# Altium schematic sheet Power Management.SchDoc
size A; SheetNumber: 2; SheetTotal: 4
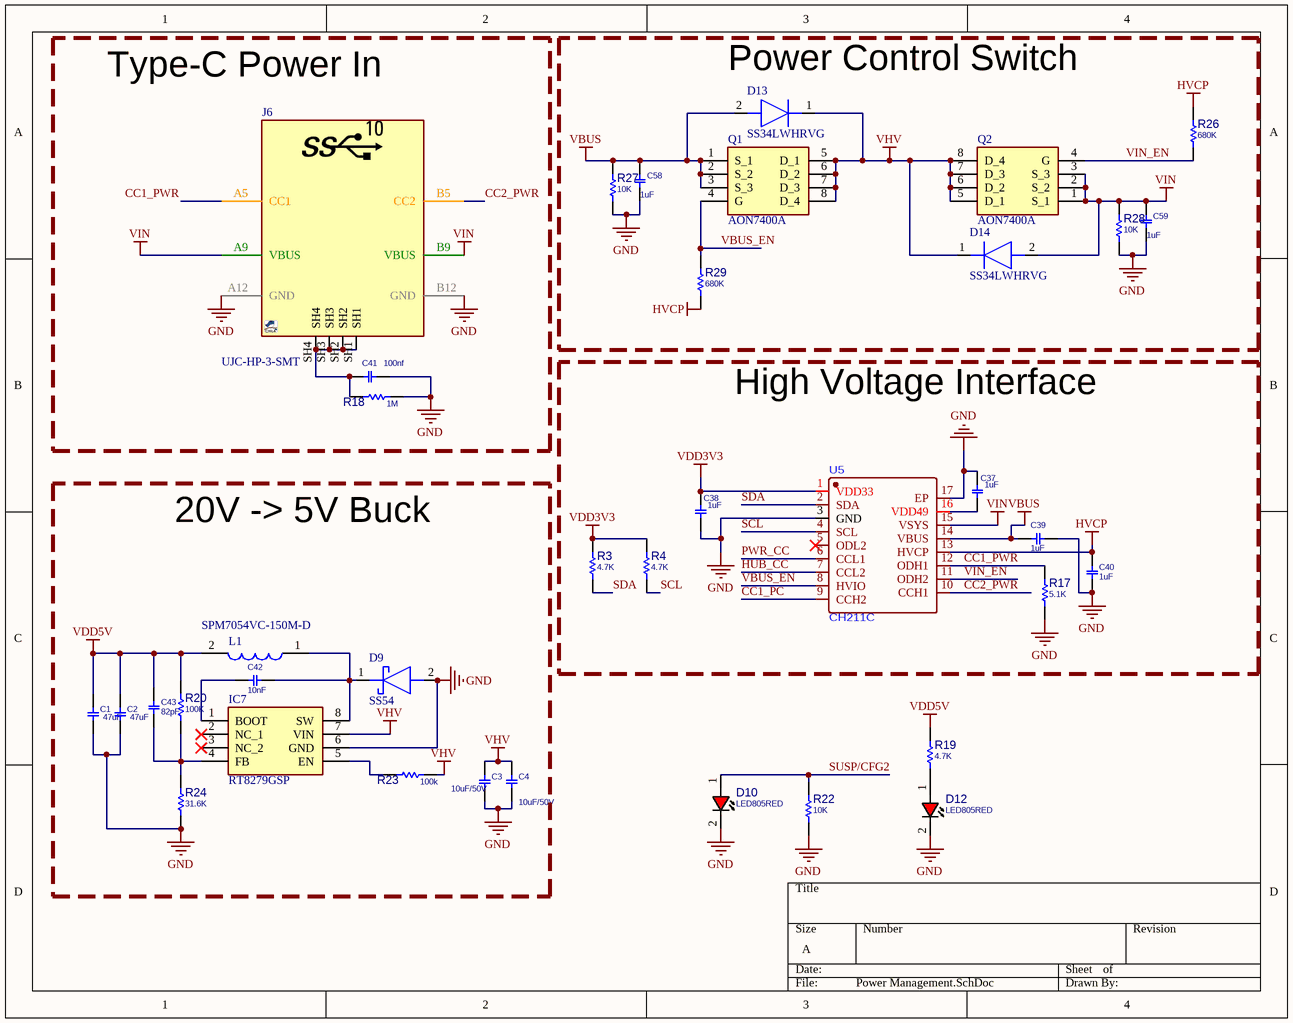
[diagram p0: Power Management.SchDoc]

## Parts
C1  47uF  [C0805]
C2  47uF  [C0805]
C3  10uF/50V  [C0805]
C4  10uF/50V  [C0805]
C37  1uF  [C0805]
C38  1uF  [C0805]
C39  1uF  [C0805]
C40  1uF  [C0805]
C41  100nf  [C1812]
C42  10nF  [C0402]
C43  82pF  [C0402]
C58  1uF  [C0402]
C59  1uF  [C0402]
D9  SS54  [DIOM5026X262N]
D10  LED805RED  [LED0805RED]
D12  LED805RED  [LED0805RED]
D13  SS34LWHRVG  [SODFL3718X102N]
D14  SS34LWHRVG  [SODFL3718X102N]
IC7  RT8279GSP  [SOIC127P600X175-8N]
J6  UJC-HP-3-SMT  [USBC_SMD_6_UJCHP3SMT]
L1  SPM7054VC-150M-D  [SPM7054VC150MD]
Q1  AON7400A  [DFN_3X3_EP]
Q2  AON7400A  [DFN_3X3_EP]
R3  4.7K  [R0402]
R4  4.7K  [R0402]
R17  5.1K  [R0402]
R18  1M  [R0805]
R19  4.7K  [R0402]
R20  100K  [R0402]
R22  10K  [R0402]
R23  100k  [R0402]
R24  31.6K  [R0402]
R26  680K  [R0402]
R27  10K  [R0402]
R28  10K  [R0402]
R29  680K  [R0402]
U5  CH211C  [QFN-16C_L2.0-W2.0-P0.40-BL-EP1.2]

## Blocks framed on the sheet
Type-C Power In: C41 J6 R18
Power Control Switch: C58 C59 D13 D14 Q1 Q2 R26-R29
High Voltage Interface: C37-C40 R3 R4 R17 U5
20V -> 5V Buck: C1-C4 C42 C43 D9 IC7 L1 R20 R23 R24

## Nets
GND: C1.1 C2.1 C3.1 C4.1 C37.2 C38.1 C39.1 C40.2 C41.2 C58.1 C59.1 D9.2(A) D10.2(CATHODE) D12.2(CATHODE) IC7.6(GND) J6.A12(GND) J6.B12(GND) R17.2 R18.1 R22.2 R24.2 R27.2 R28.2 U5.3(GND) U5.17(EP)
HVCP: C40.1 R26.2 R29.2 U5.13(HVCP)
VBUS: C39.2 C58.2 D13.2(A) Q1.1(S_1) Q1.2(S_2) Q1.3(S_3) R27.1 U5.14(VBUS)
VDD3V3: C38.2 R3.1 R4.1 U5.1(VDD33)
VDD5V: C1.2 C2.2 C43.1 L1.2 R19.1 R20.1
VHV: C3.2 C4.2 D13.1(K) D14.1(K) IC7.7(VIN) Q1.5(D_1) Q1.6(D_2) Q1.7(D_3) Q1.8(D_4) Q2.5(D_1) Q2.6(D_2) Q2.7(D_3) Q2.8(D_4) R23.1
VIN: C59.2 D14.2(A) J6.A9(VBUS) J6.B9(VBUS) Q2.1(S_1) Q2.2(S_2) Q2.3(S_3) R28.1 U5.15(VSYS)
CC1_PC: U5.9(CCH2)
CC1_PWR: J6.A5(CC1) R17.1 U5.12(ODH1)
CC2_PWR: J6.B5(CC2) U5.10(CCH1)
HUB_CC: U5.7(CCL2)
PWR_CC: U5.6(CCL1)
SCL: R4.2 U5.4(SCL)
SDA: R3.2 U5.2(SDA)
SUSP/CFG2: D10.1(ANODE) R22.1
VBUS_EN: Q1.4(G) R29.1 U5.8(HVIO)
VIN_EN: Q2.4(G) R26.1 U5.11(ODH2)
NetC37_1: C37.1 U5.16(VDD49)
NetC41_1: C41.1 J6.SH1 J6.SH2 J6.SH3 J6.SH4 R18.2
NetC42_1: C42.1 D9.1(K) IC7.8(SW) L1.1
NetC42_2: C42.2 IC7.1(BOOT)
NetC43_2: C43.2 IC7.4(FB) R20.2 R24.1
NetD12_1: D12.1(ANODE) R19.2
NetIC7_5: IC7.5(EN) R23.2

Not connected (* = marked no-connect by the designer): IC7 2(NC_1)* 3(NC_2)*; U5 5(ODL2)*

## Library data of the parts
C1-C3 C37-C40 = CAP_SMD_MLCC_0805
C4 = CAP_SMD_MLCC_0402: 50V
C41 = CAP_SMD_MLCC_1812: +1kv 100nf
C42 C43 C58 C59 = CAP_SMD_MLCC_0402
D9 = SS54: Schottky Diode; Manufacturer_Name: DIYI Elec Tech; Datasheet Link: https://datasheet.lcsc.com/szlcsc/DIYI-Elec-Tech-SS54_C84165.pdf; Height: 2.62mm; Manufacturer_Part_Number: SS54
D10 D12 = LED_SMD_0805_RED: LED, SMD, 0805, RED; DESC: DESCRIPTION; MANF_P#: MANF_PART#; PARAM2: 2.2V; MANF: MANF; ASSEMBLY: ASSEMBLY; PRICE: 36t@Javan; VALUE: LED805RED
D13 D14 = SS34LWHRVG: Diode; Manufacturer_Name: Taiwan Semiconductor; Datasheet Link: https://datasheet.datasheetarchive.com/originals/distributors/DKDS-20/389381.pdf; Height: 1.02mm; Manufacturer_Part_Number: SS34LWHRVG; Mouser Part Number: 821-SS34LWHRVG; Mouser Price/Stock: https://www.mouser.co.uk/ProductDetail/Taiwan-Semiconductor/SS34LWHRVG?qs=5aG0NVq1C4zYvYQjFNyRbA%3D%3D; Arrow Part Number: SS34LWHRVG; Arrow Price/Stock: https://www.arrow.com/en/products/ss34lwhrvg/taiwan-semiconductor?region=asia
IC7 = RT8279GSP: Integrated Circuit; Manufacturer_Name: RICHTEK; Datasheet Link: https://www.richtek.com/assets/product_file/RT8279/DS8279-01.pdf; Height: 1.753mm; Manufacturer_Part_Number: RT8279GSP
J6 = CONN_USBC_SMD_6_UJC-HP-3-SMT: CONN, USB, Type C (USB 3.1), Right-Angle, SMD; MANF: CUI Devices; PARAM2: 20v; PARAM: Power Only, 3A; Price: 0.8$; MANF_P#: UJC-HP-3-SMT; Value: UJC-HP-3-SMT
L1 = SPM7054VC-150M-D: Inductor; Manufacturer_Name: TDK; Datasheet Link: https://product.tdk.com/system/files/dam/doc/product/inductor/inductor/smd/catalog/inductor_automotive_power_spm7054vc-d_en.pdf; Height: 5.4mm; Manufacturer_Part_Number: SPM7054VC-150M-D; Mouser Part Number: 810-SPM7054VC-150M-D; Mouser Price/Stock: https://www.mouser.co.uk/ProductDetail/TDK/SPM7054VC-150M-D?qs=t7xnP681wgUXhSKXG3H9TA%3D%3D
Q1 Q2 = AON7400A: MOSFET (N-Channel); Manufacturer_Name: Alpha & Omega Semiconductors; Datasheet Link: https://www.arrow.com/en/products/aon7400a/alpha-and-omega-semiconductor; Manufacturer_Part_Number: AON7400A; Arrow Part Number: AON7400A; Arrow Price/Stock: https://www.arrow.com/en/products/aon7400a/alpha-and-omega-semiconductor.html?utm_currency=USD&region=nac
R3 R4 R17 R19 R20 R22-R24 R26-R29 = RES_SMD_0402: RESISTOR, SMD
R18 = RES_SMD_0402: RESISTOR, SMD / 0805